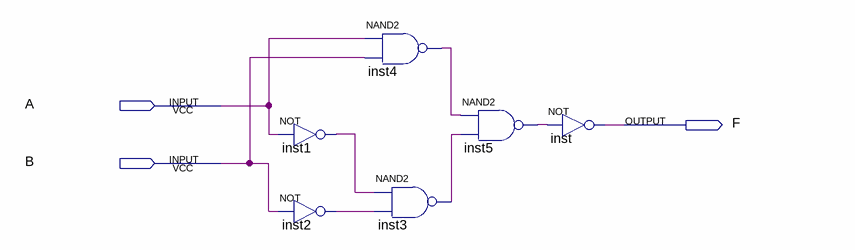
[diagram p0: schematic sheet]
// Quartus schematic XORGate.bdf as structural Verilog: 6 symbols, 3 pins
module XORGate (
  input  A,
  input  B,
  output F
);

  wire inst1_out, inst2_out, inst3_out, inst4_out, inst5_out;

  not inst1 (inst1_out, A);
  not inst2 (inst2_out, B);
  nand inst4 (inst4_out, A, B);
  nand inst3 (inst3_out, inst1_out, inst2_out);
  nand inst5 (inst5_out, inst4_out, inst3_out);
  not inst (F, inst5_out);
endmodule
